# Altium schematic sheet Prometheus_MOSFET_V1.1.SchDoc
size A
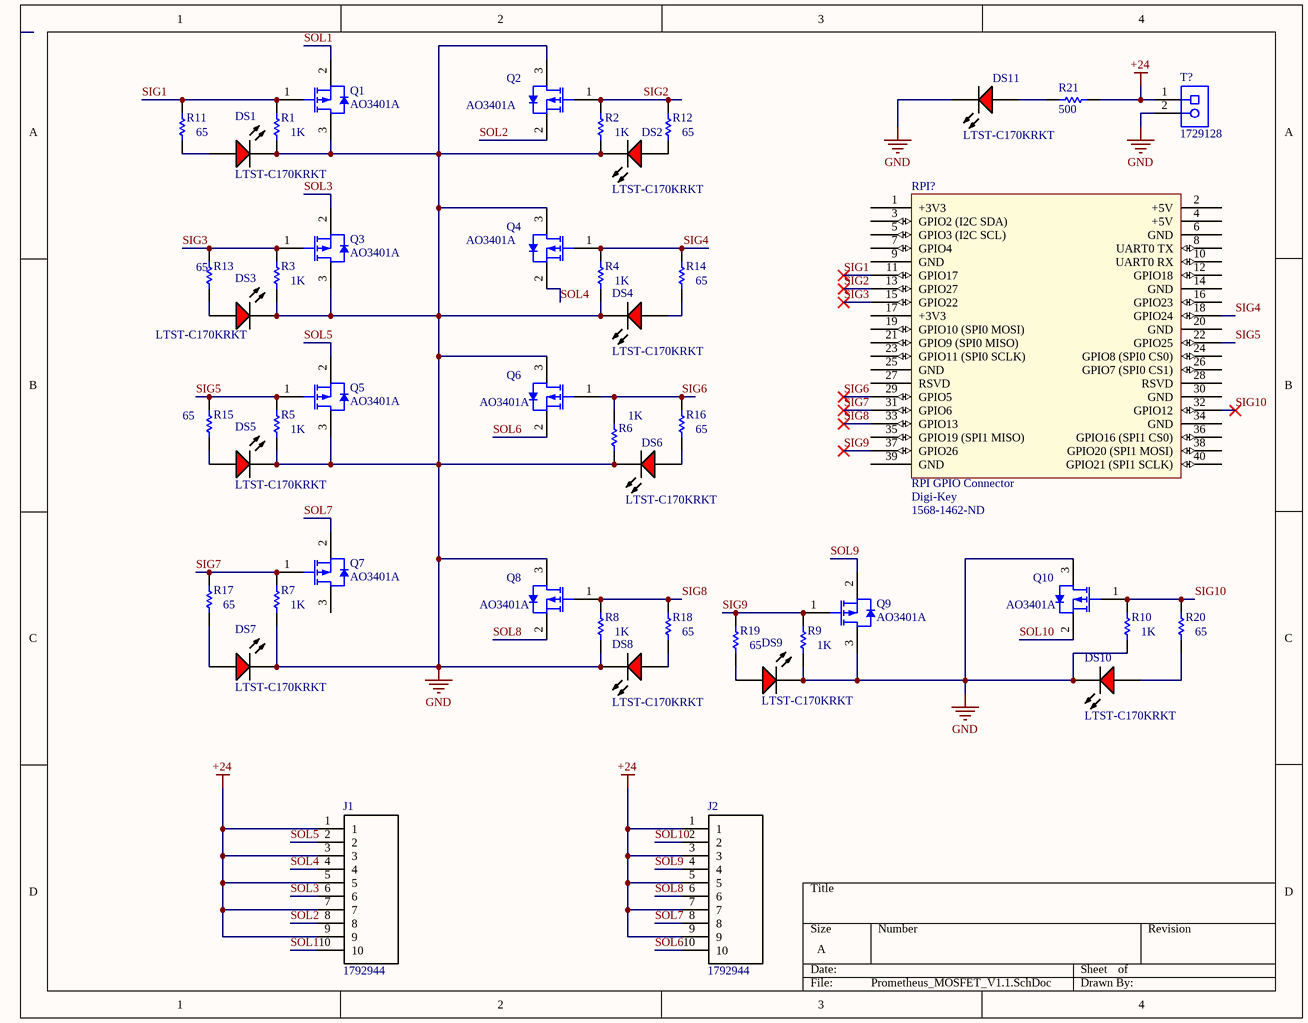
[diagram p0: Prometheus_MOSFET_V1.1.SchDoc]

## Parts
DS1  LTST-C170KRKT  [LTST-C170KRKT_V]
DS2  LTST-C170KRKT  [LTST-C170KRKT_V]
DS3  LTST-C170KRKT  [LTST-C170KRKT_V]
DS4  LTST-C170KRKT  [LTST-C170KRKT_V]
DS5  LTST-C170KRKT  [LTST-C170KRKT_V]
DS6  LTST-C170KRKT  [LTST-C170KRKT_V]
DS7  LTST-C170KRKT  [LTST-C170KRKT_V]
DS8  LTST-C170KRKT  [LTST-C170KRKT_V]
DS9  LTST-C170KRKT  [LTST-C170KRKT_V]
DS10  LTST-C170KRKT  [LTST-C170KRKT_V]
DS11  LTST-C170KRKT  [LTST-C170KRKT_V]
J1  1792944  [SHDR10W100P0X500_1X10_5000X1050X1360P]
J2  1792944  [SHDR10W100P0X500_1X10_5000X1050X1360P]
Q1  AO3401A  [AO-SOT-23-3L_V]
Q2  AO3401A  [AO-SOT-23-3L_V]
Q3  AO3401A  [AO-SOT-23-3L_V]
Q4  AO3401A  [AO-SOT-23-3L_V]
Q5  AO3401A  [AO-SOT-23-3L_V]
Q6  AO3401A  [AO-SOT-23-3L_V]
Q7  AO3401A  [AO-SOT-23-3L_V]
Q8  AO3401A  [AO-SOT-23-3L_V]
Q9  AO3401A  [AO-SOT-23-3L_V]
Q10  AO3401A  [AO-SOT-23-3L_V]
R1  1K  [RESC1206(3216)_M]
R2  1K  [RESC1206(3216)_M]
R3  1K  [RESC1206(3216)_M]
R4  1K  [RESC1206(3216)_M]
R5  1K  [RESC1206(3216)_M]
R6  1K  [RESC1206(3216)_M]
R7  1K  [RESC1206(3216)_M]
R8  1K  [RESC1206(3216)_M]
R9  1K  [RESC1206(3216)_M]
R10  1K  [RESC1206(3216)_M]
R11  65  [RESC1206(3216)_M]
R12  65  [RESC1206(3216)_M]
R13  65  [RESC1206(3216)_M]
R14  65  [RESC1206(3216)_M]
R15  65  [RESC1206(3216)_M]
R16  65  [RESC1206(3216)_M]
R17  65  [RESC1206(3216)_M]
R18  65  [RESC1206(3216)_M]
R19  65  [RESC1206(3216)_M]
R20  65  [RESC1206(3216)_M]
R21  500  [RESC1206(3216)_M]
RPI?  RPI GPIO Connector  Supplier 1: Digi-Key  Supplier Part Number 1: 1568-1462-ND  [rpi]
T?  1729128  [PHOE-1729128-2_V]

## Nets
+24: J1.1 J1.3 J1.5 J1.7 J1.9 J2.1 J2.3 J2.5 J2.7 J2.9 R21.1 T?.1
GND: DS1.2(K) DS2.2(K) DS3.2(K) DS4.2(K) DS5.2(K) DS6.2(K) DS7.2(K) DS8.2(K) DS9.2(K) DS10.2(K) DS11.2(K) Q1.3(DRAIN) Q2.3(DRAIN) Q3.3(DRAIN) Q4.3(DRAIN) Q5.3(DRAIN) Q6.3(DRAIN) Q8.3(DRAIN) Q9.3(DRAIN) Q10.3(DRAIN) R1.1 R2.1 R3.1 R4.1 R5.1 R6.1 R7.1 R8.1 R9.1 R10.1 T?.2
SIG1: Q1.1(GATE) R1.2 R11.2 RPI?.11(GPIO17)
SIG2: Q2.1(GATE) R2.2 R12.2 RPI?.13(GPIO27)
SIG3: Q3.1(GATE) R3.2 R13.2 RPI?.15(GPIO22)
SIG4: Q4.1(GATE) R4.2 R14.2 RPI?.18(GPIO24)
SIG5: Q5.1(GATE) R5.2 R15.2 RPI?.22(GPIO25)
SIG6: Q6.1(GATE) R6.2 R16.2 RPI?.29(GPIO5)
SIG7: Q7.1(GATE) R7.2 R17.2 RPI?.31(GPIO6)
SIG8: Q8.1(GATE) R8.2 R18.2 RPI?.33(GPIO13)
SIG9: Q9.1(GATE) R9.2 R19.2 RPI?.37(GPIO26)
SIG10: Q10.1(GATE) R10.2 R20.2 RPI?.32(GPIO12)
SOL1: J1.10 Q1.2(SOURCE)
SOL2: J1.8 Q2.2(SOURCE)
SOL3: J1.6 Q3.2(SOURCE)
SOL4: J1.4 Q4.2(SOURCE)
SOL5: J1.2 Q5.2(SOURCE)
SOL6: J2.10 Q6.2(SOURCE)
SOL7: J2.8 Q7.2(SOURCE)
SOL8: J2.6 Q8.2(SOURCE)
SOL9: J2.4 Q9.2(SOURCE)
SOL10: J2.2 Q10.2(SOURCE)
NetDS1_1: DS1.1(A) R11.1
NetDS2_1: DS2.1(A) R12.1
NetDS3_1: DS3.1(A) R13.1
NetDS4_1: DS4.1(A) R14.1
NetDS5_1: DS5.1(A) R15.1
NetDS6_1: DS6.1(A) R16.1
NetDS7_1: DS7.1(A) R17.1
NetDS8_1: DS8.1(A) R18.1
NetDS9_1: DS9.1(A) R19.1
NetDS10_1: DS10.1(A) R20.1
NetDS11_1: DS11.1(A) R21.2

Not connected (* = marked no-connect by the designer): Q7 3(DRAIN); RPI? 1(+3V3) 2(+5V) 3(GPIO2_(I2C_SDA)) 4(+5V) 5(GPIO3_(I2C_SCL)) 6(GND) 7(GPIO4) 8(UART0_TX) 9(GND) 10(UART0_RX) 12(GPIO18) 14(GND) 16(GPIO23) 17(+3V3) 19(GPIO10_(SPI0_MOSI)) 20(GND) 21(GPIO9_(SPI0_MISO)) 23(GPIO11_(SPI0_SCLK)) 24(GPIO8_(SPI0_CS0)) 25(GND) 26(GPIO7_(SPI0_CS1)) 27(RSVD) 28(RSVD) 30(GND) 34(GND) 35(GPIO19_(SPI1_MISO)) 36(GPIO16_(SPI1_CS0)) 38(GPIO20_(SPI1_MOSI)) 39(GND) 40(GPIO21_(SPI1_SCLK))

## Library data of the parts
DS1-DS11 = CMP-2000-07593-1: LED Red, 75 mW, 54 mcd, -55 to 85 degC, 2-Pin SMD, RoHS, Tape and Reel; Manufacturer: Lite-On; Lens Transparency: Clear; Number of Elements: 1; Power Rating: 75mW; Luminous Intensity: 54mcd; Viewing Angle: 130degrees; Forward Current: 30mA; Wavelength: 639nm; Lens Style: Rectangular; Case\/Package: 0805; Test Current: 20mA; Dominant Wavelength: 631nm; Forward Voltage: 2V; Lens Colour: Colorless; Min Operating Temperature: -55degC; RoHSCompliant: True; Length: 3.2mm; Width: 1.25mm; Mount: SurfaceMount; Packaging: TapeandReel; Number of LEDs: 1; Radiation Hardening: No; Datasheet URL: http://optoelectronics.liteon.com/upload/download/DS-22-99-0150/LTST-C170KRKT.pdf; Datasheet Version: Rev. D, 11/2014; Case Code (Metric): 2012; Height: 1.1mm; Number of Pins: 2; Package Description: 2-Pin Surface Mount Device, Body 2 x 1.25 mm; Manufacturer URL: http://www.us.liteon.com/; Lead Free: LeadFree; Illumination Colour: Red; Colour: Red; Case Code (Imperial): 0805; Max Operating Temperature: 85degC; Power Dissipation: 75mW; Mounting Technology: SurfaceMount; Package Reference: C170KRKT; Package Quantity: 1; Depth: 1.6mm
J1 J2 = 1792944: Connector; Manufacturer_Name: Phoenix Contact; Datasheet Link: https://www.phoenixcontact.com/online/portal/gb/?uri=pxc-oc-itemdetail:pid=1792944&library=gben&pcck=P-11-01-05&tab=1&selectedCategory=ALL; Height: 13.6mm; Manufacturer_Part_Number: 1792944; Mouser Part Number: 651-1792944; Mouser Price/Stock: https://www.mouser.com/Search/Refine.aspx?Keyword=651-1792944; RS Part Number: 8019986; RS Price/Stock: http://uk.rs-online.com/web/p/products/8019986
Q1-Q10 = CMP-2000-05778-1: P-Channel MOSFET, 30 V, 4 A, -55 to 150 degC, 3-Pin SOT-23-3L, RoHS, Tape and Reel; Manufacturer: Alpha and Omega; Output Power (Max): NotRequiredW; Power Dissipation: 1.4W; Rad Hardened: No; Drain Efficiency: NotRequired%; Drain-Source On-Volt: 30V; Noise Figure: NotRequireddB; Frequency (Max): NotRequiredMHz; Number of  Elements: 1; Gate-Source Voltage (Max): ?12V; Drain Current (Max): 4A; Channel Mode: Enhancement; Drain-Source On-Res: 0.044ohm; Type: PowerMOSFET; Polarity: P; Package URL: http://www.aosmd.com/res/packaging_information/SOT-23-3L.pdf; Datasheet URL: http://www.aosmd.com/res/data_sheets/AO3401A.pdf; Package Type: SOT-23; Package Description: 3-Pin Small Outline Transistor, Body 2.95 x 1.6 mm, Pitch 0.95 mm; Mounting: SurfaceMount; Manufacturer URL: http://www.aosmd.com/; Continuous Drain Current: 4A; Package Reference: SOT-23-3L; Mounting Technology: SurfaceMount; Operating Temperature Classification: Military; Power Gain: NotRequireddB; Datasheet Version: Rev. 3, 03/2011; Operating Temp Range: -55Cto150C; Pin Count: 3
R1-R21 = CMP-1014-00526-1: 1K43 0.25W 1% 1206 (3216 Metric)  SMD; Value: 1430.00 Ohm; Case-EIA: 1206; Case-Metric: 3216; Power: 0.25 W; Technology: SMT; Tolerance: 1 %
RPI? = rpi connector: GPIO Header for Raspberry Pi A+/B+/Pi 2/Pi 3 - 2x20; Manufacturer: SparkFun Electronics; Manufacturer Part Number: PRT-14017; Nils Minor: author; nilsminor@web.de: mail; RoHS: RoHS Compliant; Category: Development Boards, Kits, Programmers; Stock 1: 150; Pricing 1: 1=1.84 (EUR); Part Status: Active; Accessory Type: Connector; For Use With/Related Products: Raspberry Pi; ComponentLink1URL: https://cdn.sparkfun.com/datasheets/Dev/RaspberryPi/12313.pdf; ComponentLink1Description: https://cdn.sparkfun.com/datasheets/Dev/RaspberryPi/12313.pdf
T? = CMP-2000-05815-1: PCB Terminal Block, 13.5 A, 400 V, 2-Pin THD, RoHS, Bulk; Manufacturer: Phoenix Contact; Package Version: 03/2015; No. of Rows: 1; Pitch: 5.08mm; No. of Positions: 2; Voltage Rating: 400V; Current Rating: 13500mA; Manufacturer URL: http://www.phoenixcontact.com/; Datasheet URL: https://datasheet.ciiva.com/16046/1729128-16046181.pdf; RoHS: TRUE; Package URL: https://www.phoenixcontact.com/online/portal/pi/pxc/product_detail_page/!ut/p/b1/3VdJjqNKFDxLH8AFycySyWY2ozFsEPOMMQaDOX1XedGL_1Vdm5YXJleknhSKeBkvI6EA8ncAo3AYoDhBQGco6KN7VURTdemj9us_IEKEZo_YHiPAEWEFmDGOHMORkqKYCORBZxgL7ZoaZYcbFFUZ3fqxSY6GOuxydWUuHqz1ynmMFygu583Bob0Ewr6Sd_l-5m-kAueHiB0jpRwZwe58wwtkpxtMYd_LmGcDRU02dRNEyWt6Y2ti5pSyJ_reIkzIulrqApdnbT11V5jnCKbYNCvhEM1MCpPByat_X379-iThf08CI5GfOPqfBeS3BRoBOdD55AKVv0iLwCMq-2BrzXWSGRH7pUGD9uwXQjiph3xL0DKQwdGa0JImiIOmBNOestqgwTHSSs2oOep-78apyXQBvNi8ZLaFjvjWvcaUEBu0MC6Wbe-d6mB0FAebo2lUWinqYaZs5DAYzV0RP9yitUjnGJ0iI9xhZkT42OCQNUJJhkgWINNQLP2JFP6OpMg3JCVg70jqHT0lvKOnhHf0lPuOnnLf0VPuWx6_dxwUIvwk5WMkT0kLL1mh61l2yZVSzG3pYV_bqo-mj6uMKwKwdnnW8Jh5RTOJzMOA5c-eJDaZQw4mTMPH02PvS_ZAqNVjVTo2WyYLkwH_KU1mmmG5kjRhDqPXLwwVHvVOjCM60-fpXvTDfMGW1PVFVS1r4e4yVDk4ZdNbkUHvqPqQSeian4UD39fNKmachqdJ1NJbyk8rXT9mXTvPk3oE5meulKGgiruPJek-4I9hTT6G8ZLOyRSm2RRVbThERQad5OS28hdt4YW4vG0stgYYzsWsK4_7y6DZMjJSCqri1kyiZR5vD7pwIrNR7QwPHTcLTI5qT7eRlpHrdGiupYlqQDJ7zy_CND8fWWBoLRXxk1RVcXiBQwbTD4Xi7KL-FuO94t9xaqweXzH; PartNumber: 1729128; Package Description: 2-Pin Through Hole Device, Body 8.1 x 10.16 mm, Pitch 5.08 mm; Datasheet Version: 12/2013; Mounting Technology: ThroughHole; Orientation: Horizontal; Package Reference: 1729128-2; Packing: Bulk